# EAGLE design Edge Touch Module (EAGLE 6.3)
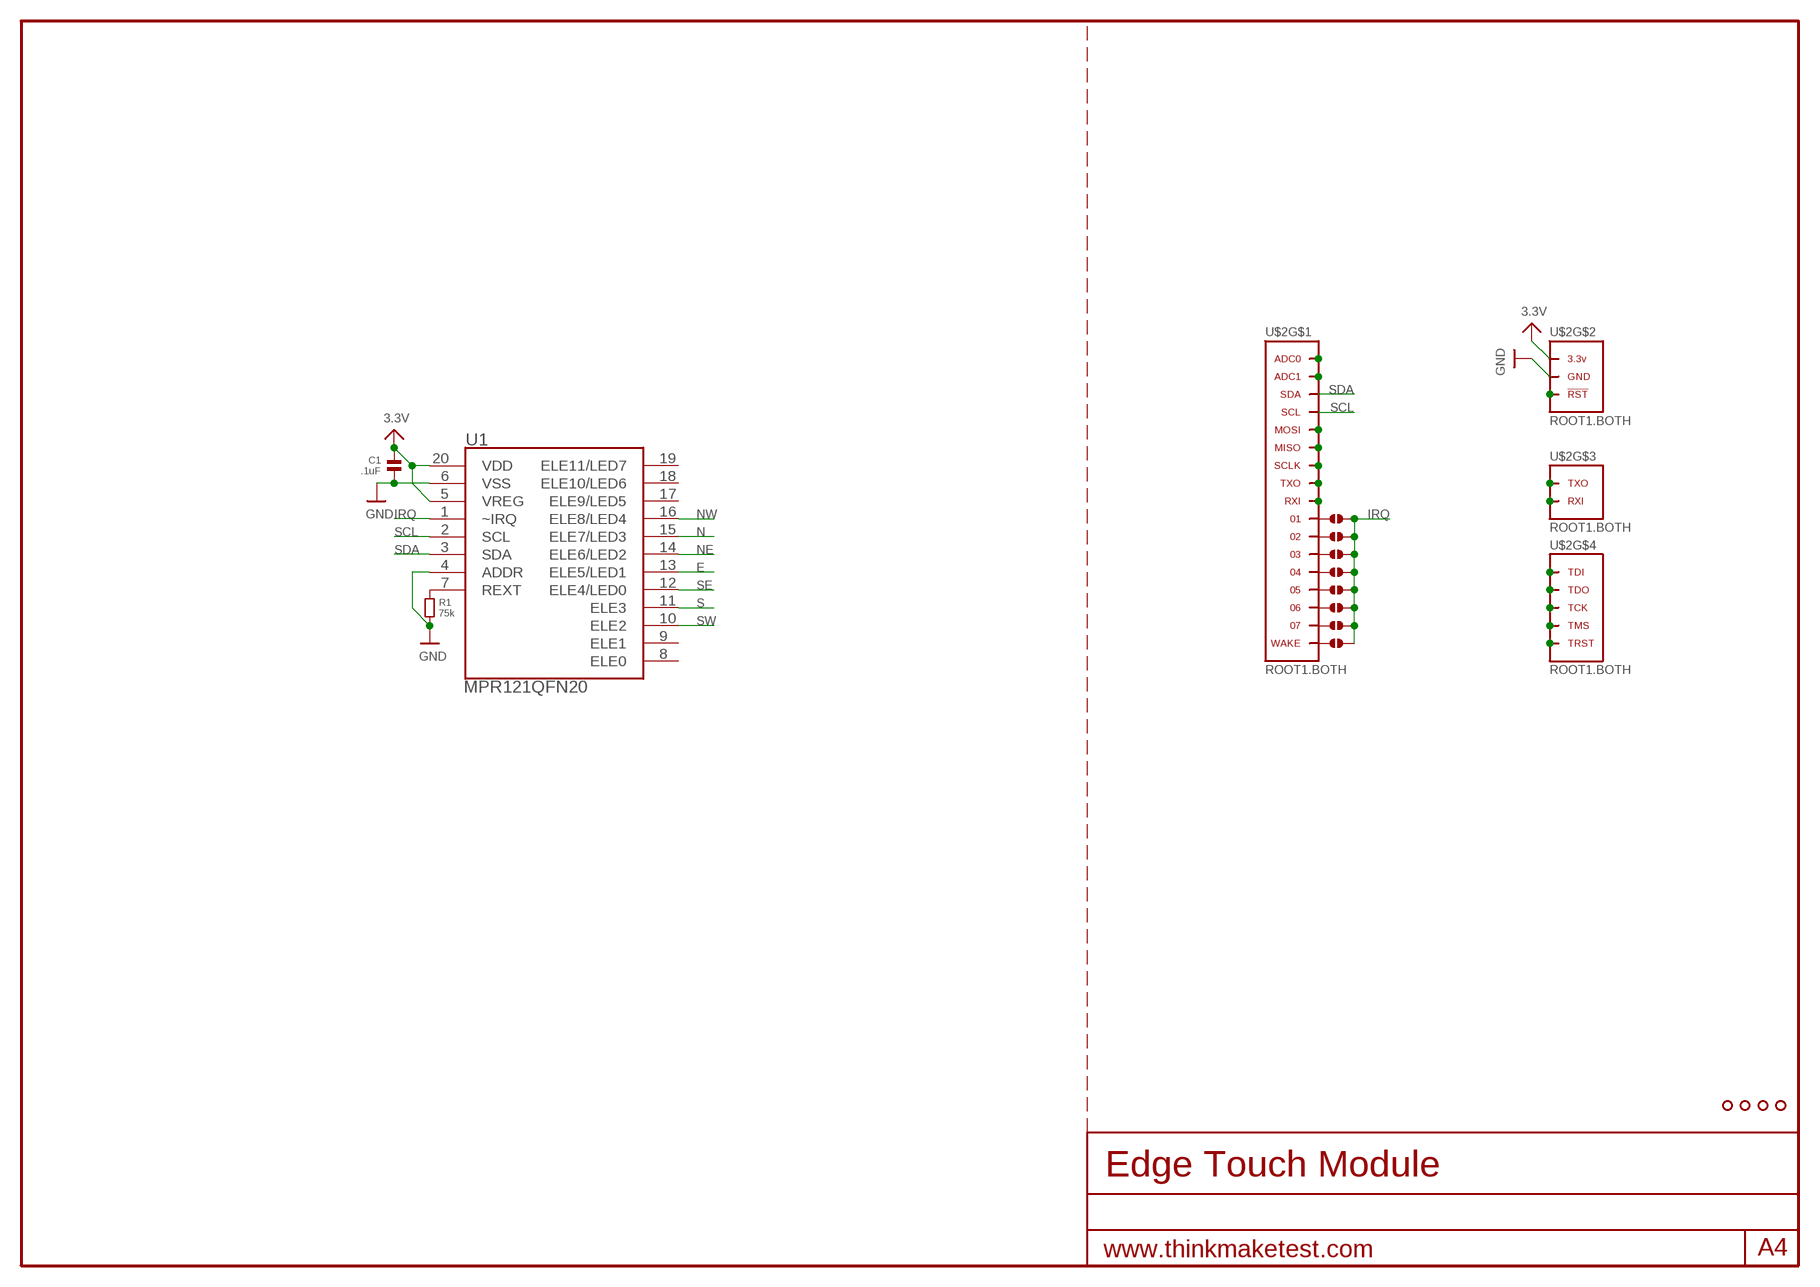
[diagram p0: schematic, sheet 1]

## Parts
1  SOLDERJUMPER.2.SML  [2.SML]
8  SOLDERJUMPER.2.SML  [2.SML]
C1  .1uF  CAPACITOR.0603  [0603]
J2  SOLDERJUMPER.2.SML  [2.SML]
J3  SOLDERJUMPER.2.SML  [2.SML]
J4  SOLDERJUMPER.2.SML  [2.SML]
J5  SOLDERJUMPER.2.SML  [2.SML]
J6  SOLDERJUMPER.2.SML  [2.SML]
J7  SOLDERJUMPER.2.SML  [2.SML]
R1  75k  RESISTOR.0603  [0603]
U1  MPR121QFN20  [QFN-20-0.4MM]
U$2  ROOT1.BOTH  [ROOT1.BOTH]
U$3  HOLE.#2  [#2]
U$4  HOLE.#2  [#2]
U$9  HOLE.#2  [#2]
U$10  HOLE.#2  [#2]

## Nets
3.3V: C1.1 U1.5(VREG) U1.20(VDD) U$2.3.3V@1(3.3V) U$2.3.3V@2(3.3V) U$2.3.3V@3(3.3V) U$2.3.3V@4(3.3V) U$2.3.3V@5(3.3V) U$2.3.3V@6(3.3V) U$2.3.3V@7(3.3V) U$2.3.3V@8(3.3V) U$2.3.3V@9(3.3V) U$2.3.3V@10(3.3V) U$2.3.3V@11(3.3V) U$2.3.3V@12(3.3V) U$2.3.3V@13(3.3V) U$2.3.3V@14(3.3V) U$2.3.3V@15(3.3V) U$2.3.3V@16(3.3V) U$2.3.3V@17(3.3V) U$2.3.3V@18(3.3V) U$2.3.3V@19(3.3V) U$2.3.3V@20(3.3V) U$2.3.3V@21(3.3V) U$2.3.3V@22(3.3V) U$2.3.3V@23(3.3V) U$2.3.3V@24(3.3V) U$2.3.3V@VIA(3.3V)
E: U1.13(ELE5/LED1)
GND: C1.2 R1.2 U1.4(ADDR) U1.6(VSS) U$2.GND@1(GND) U$2.GND@2(GND) U$2.GND@3(GND) U$2.GND@4(GND) U$2.GND@5(GND) U$2.GND@6(GND) U$2.GND@7(GND) U$2.GND@8(GND) U$2.GND@9(GND) U$2.GND@10(GND) U$2.GND@11(GND) U$2.GND@12(GND) U$2.GND@13(GND) U$2.GND@14(GND) U$2.GND@15(GND) U$2.GND@16(GND) U$2.GND@17(GND) U$2.GND@18(GND) U$2.GND@19(GND) U$2.GND@20(GND) U$2.GND@21(GND) U$2.GND@22(GND) U$2.GND@23(GND) U$2.GND@24(GND) U$2.GND@25(GND) U$2.GND@26(GND) U$2.GND@VIA(GND)
IRQ: 1.2 8.2 J2.2 J3.2 J4.2 J5.2 J6.2 J7.2 U1.1(~IRQ)
N: U1.15(ELE7/LED3)
N$1: 1.1 U$2.01 U$2.01@1 U$2.01@VIA
N$2: U$2.ADC1 U$2.ADC1@1(ADC1) U$2.ADC1@VIA(ADC1)
N$3: J2.1 U$2.02 U$2.02@1 U$2.02@VIA
N$5: J3.1 U$2.03 U$2.03@1 U$2.03@VIA
N$6: U$2.MISO U$2.MISO@1(MISO) U$2.MISO@VIA(MISO)
N$7: U$2.SCLK U$2.SCLK@1(SCLK) U$2.SCLK@VIA(SCLK)
N$8: U$2.TXO U$2.TXO@1(TXO) U$2.TXO@VIA(TXO)
N$9: U$2.RXI U$2.RXI@1(RXI) U$2.RXI@VIA(RXI)
N$10: J4.1 U$2.04 U$2.04@1 U$2.04@VIA
N$11: J5.1 U$2.05 U$2.05@1 U$2.05@VIA
N$12: U$2.MOSI U$2.MOSI@1(MOSI) U$2.MOSI@VIA(MOSI)
N$13: U$2.ADC0 U$2.ADC0@1(ADC0) U$2.ADC0@VIA(ADC0)
N$14: J6.1 U$2.06 U$2.06@1 U$2.06@VIA
N$15: J7.1 U$2.07 U$2.07@1 U$2.07@VIA
N$16: 8.1 U$2.WAKE U$2.WAKE@1(WAKE) U$2.WAKE@VIA(WAKE)
N$18: U$2.TDI U$2.TDI@1(TDI) U$2.TDI@VIA(TDI)
N$19: U$2.TDO U$2.TDO@1(TDO) U$2.TDO@VIA(TDO)
N$20: U$2.TCK U$2.TCK@1(TCK) U$2.TCK@VIA(TCK)
N$21: U$2.TMS U$2.TMS@1(TMS) U$2.TMS@VIA(TMS)
N$22: U$2.TRST U$2.TRST@1(TRST) U$2.TRST@VIA(TRST)
N$23: U$2.RXI.DBG(RXI) U$2.RXI.DBG@1(RXI) U$2.RXI.DBG@VIA(RXI)
N$24: U$2.TXO.DBG(TXO) U$2.TXO.DBG@1(TXO) U$2.TXO.DBG@VIA(TXO)
N$25: U$2.RST(!RST) U$2.RST@1(!RST) U$2.RST@VIA(!RST)
N$26: R1.1 U1.7(REXT)
NE: U1.14(ELE6/LED2)
NW: U1.16(ELE8/LED4)
S: U1.11(ELE3)
SCL: U1.2(SCL) U$2.SCL U$2.SCL@1(SCL) U$2.SCL@VIA(SCL)
SDA: U1.3(SDA) U$2.SDA U$2.SDA@1(SDA) U$2.SDA@VIA(SDA)
SE: U1.12(ELE4/LED0)
SW: U1.10(ELE2)
Unconnected: U1.8(ELE0) U1.9(ELE1) U1.17(ELE9/LED5) U1.18(ELE10/LED6) U1.19(ELE11/LED7)

## Library data of the parts
1 8 J2-J7 = .solderjumper:SOLDERJUMPER.2
C1 = .standardparts:CAPACITOR
R1 = .standardparts:RESISTOR
U1 = SparkFun-Sensors:MPR121: MPR121 Capacitive Touch Sensor Controller
U$2 = thinkmaketest:ROOT1
U$3 U$4 U$9 U$10 = .screw_holes:HOLE

## Board
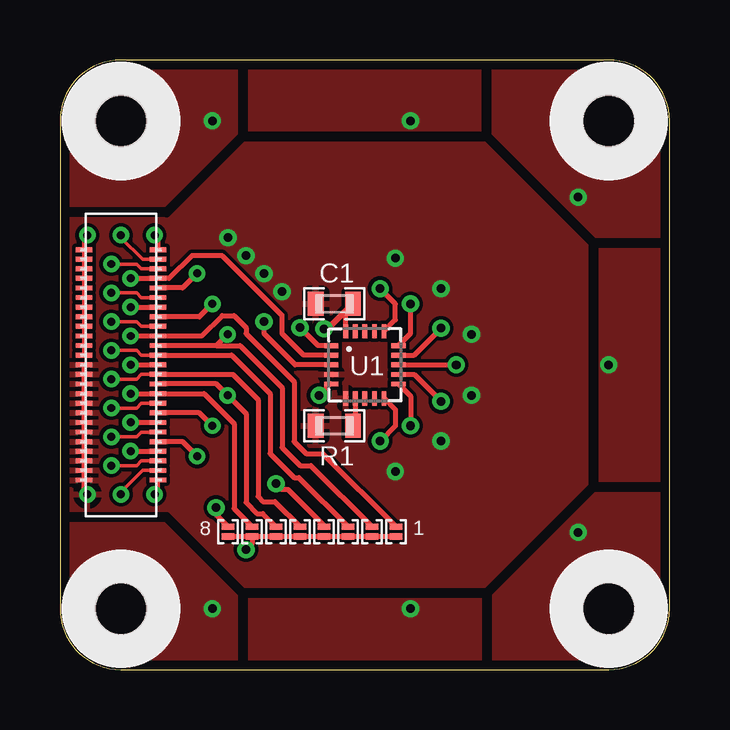
[diagram p1: board, top side]
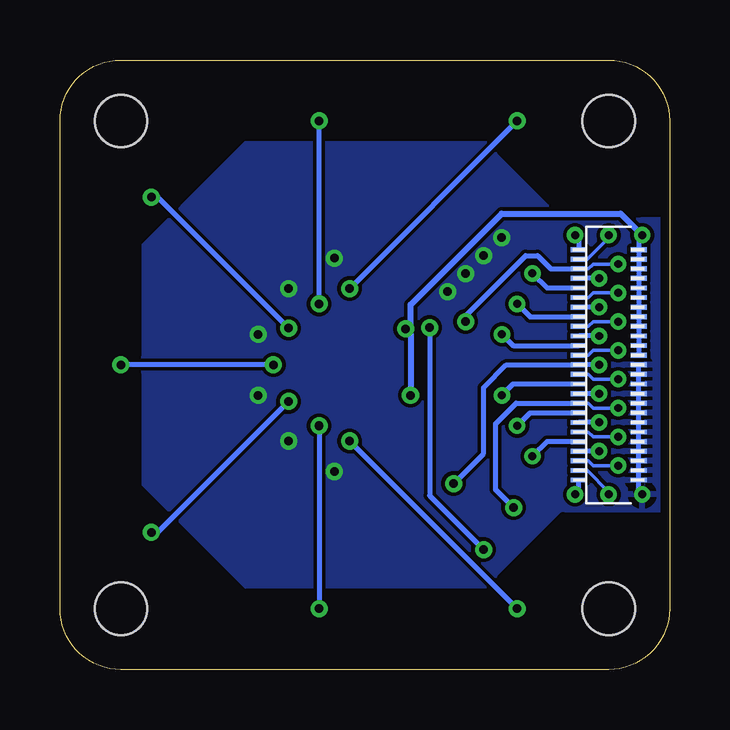
[diagram p2: board, bottom side, seen from below]

Size 25.4 x 25.4 mm. Coordinates in mm from the lower left corner, seen from the top.
Outline: 0,22.86 0,2.54 arc90 2.54,0 22.86,0 arc90 25.4,2.54 25.4,22.86 arc90 22.86,25.4 2.54,25.4 arc90 0,22.86
Copper layers (1*16): Top 0.0356mm / dielectric 1.5011mm / Bottom 0.0356mm
Design rules "default": minimum track width 6mil, minimum drill 13mil, track to track 6mil, track to pad 6mil, pad to pad 6mil, via to via 6mil, smd to smd 6mil, copper to edge 15mil, drill to drill 6mil, minimum pad ring 7mil, minimum via ring 7mil, stop-mask expansion 4mil, vias tented up to drill 16mil, thermal gap 10mil
tRestrict: 15 lines
bRestrict: 14 lines

### Footprints (pad centres in the part's own frame; a part is rotated, then mirrored left to right if it is on the bottom)
2.SML = smd 0.254 x 0.508: 1 -0.203,0; 2 0.203,0
0603 = smd 0.65 x 1: 1 -0.775,0; 2 0.775,0
QFN-20-0.4MM = smd 0.6 x 0.2: 1 -1.4,0.8; 2 -1.4,0.4; 3 -1.4,0; 4 -1.4,-0.4; 5 -1.4,-0.8; 11 1.4,-0.8; 12 1.4,-0.4; 13 1.4,0; 14 1.4,0.4; 15 1.4,0.8 | smd 0.2 x 0.6: 6 -0.8,-1.4; 7 -0.4,-1.4; 8 0,-1.4; 9 0.4,-1.4; 10 0.8,-1.4; 16 0.8,1.4; 17 0.4,1.4; 18 0,1.4; 19 -0.4,1.4; 20 -0.8,1.4
ROOT1.BOTH = smd 0.66 x 0.2 bottom: 01 3.795,13.9; 02 3.795,13.5; 03 3.795,13.1; 3.3V@1 1.285,17.5; 3.3V@2 1.285,17.1; 3.3V@3 1.285,16.7; 3.3V@4 1.285,16.3; 3.3V@5 1.285,15.9; 3.3V@6 1.285,15.5; 3.3V@7 1.285,15.1; 3.3V@8 1.285,14.7; 3.3V@9 1.285,14.3; 3.3V@10 1.285,13.9; 3.3V@11 1.285,13.5; 3.3V@12 1.285,13.1; 04 3.795,12.7; 05 3.795,12.3; 06 3.795,11.9; 07 3.795,11.5; ADC0 3.795,17.5; ADC1 3.795,17.1; GND@1 1.285,7.9; GND@2 1.285,8.3; GND@3 1.285,8.7; GND@4 1.285,9.1; GND@5 1.285,9.5; GND@6 1.285,9.9; GND@7 1.285,10.3; GND@8 1.285,10.7; GND@9 1.285,11.1; GND@10 1.285,11.5; GND@11 1.285,11.9; GND@12 1.285,12.3; GND@13 1.285,12.7; MISO 3.795,15.5; MOSI 3.795,15.9; RST 3.795,7.9; RXI 3.795,14.3; RXI.DBG 3.795,10.3; SCL 3.795,16.3; SCLK 3.795,15.1; SDA 3.795,16.7; TCK 3.795,9.1; TDI 3.795,9.9; TDO 3.795,9.5; TMS 3.795,8.7; TRST 3.795,8.3; TXO 3.795,14.7; TXO.DBG 3.795,10.7; WAKE 3.795,11.1 | smd 0.7 x 0.2: 01@1 4.08,13.9; 02@1 4.08,13.5; 3.3V@13 1,17.5; 3.3V@14 1,17.1; 3.3V@15 1,16.7; 3.3V@16 1,16.3; 3.3V@17 1,15.9; 3.3V@18 1,15.5; 3.3V@19 1,15.1; 3.3V@20 1,14.7; 3.3V@21 1,14.3; 3.3V@22 1,13.9; 3.3V@23 1,13.5; 3.3V@24 1,13.1; 03@1 4.08,13.1; 04@1 4.08,12.7; 05@1 4.08,12.3; 06@1 4.08,11.9; 07@1 4.08,11.5; ADC0@1 4.08,17.5; ADC1@1 4.08,17.1; GND@14 1,7.9; GND@15 1,8.3; GND@16 1,8.7; GND@17 1,9.1; GND@18 1,9.5; GND@19 1,9.9; GND@20 1,10.3; GND@21 1,10.7; GND@22 1,11.1; GND@23 1,11.5; GND@24 1,11.9; GND@25 1,12.3; GND@26 1,12.7; MISO@1 4.08,15.5; MOSI@1 4.08,15.9; RST@1 4.08,7.9; RXI.DBG@1 4.08,10.3; RXI@1 4.08,14.3; SCL@1 4.08,16.3; SCLK@1 4.08,15.1; SDA@1 4.08,16.7; TCK@1 4.08,9.1; TDI@1 4.08,9.9; TDO@1 4.08,9.5; TMS@1 4.08,8.7; TRST@1 4.08,8.3; TXO.DBG@1 4.08,10.7; TXO@1 4.08,14.7; WAKE@1 4.08,11.1 | drill 0.33 pad 0.686: 01@VIA 2.94,13.9; 02@VIA 6.985,13.97; 3.3V@VIA 1.14,18.1; 03@VIA 2.14,13.3; 04@VIA 2.94,12.7; 05@VIA 2.14,12.1; 06@VIA 6.985,11.43; 07@VIA 2.94,11.5; ADC0@VIA 3.94,18.1; ADC1@VIA 2.54,18.1; GND@VIA 1.14,7.3; MISO@VIA 2.14,15.7; MOSI@VIA 5.715,16.51; RST@VIA 3.94,7.3; RXI.DBG@VIA 2.94,10.3; RXI@VIA 2.14,14.5; SCL@VIA 2.94,16.3; SCLK@VIA 2.94,15.1; SDA@VIA 2.14,16.9; TCK@VIA 2.94,9.1; TDI@VIA 2.14,9.7; TDO@VIA 5.715,8.89; TMS@VIA 2.14,8.5; TRST@VIA 2.54,7.3; TXO.DBG@VIA 6.35,10.16; TXO@VIA 6.35,15.24; WAKE@VIA 2.14,10.9
#2 = hole 2.184: 0,0

### Placement (x,y rotation side)
1  14,5.75 270 top
8  7,5.75 270 top
C1  11.43,15.24 180 top
J2  13,5.75 270 top
J3  12,5.75 270 top
J4  11,5.75 270 top
J5  10,5.75 270 top
J6  9,5.75 270 top
J7  8,5.75 270 top
R1  11.43,10.16 180 top
U1  12.7,12.7 0 top
U$2  0,0 0 top
U$3  2.54,2.54 90 top
U$4  2.54,22.86 90 top
U$9  22.86,22.86 0 top
U$10  22.86,2.54 0 top

### Tracks (layer width: path | path; a pad name or v marks a point on that pad's centre or on a via)
3.3V  (via drill 0.36)
  Top 0.203: U1.5 11.27,11.9 v10.79,11.43 | U1.20 11.9,14.94 C1.1
  Top 0.254: C1.1 11.16,14.2 v11,14.2
  Bottom 0.254: v11,14.2 10.79,13.99 | 10.79,13.99 v10.79,11.43 | 10.79,13.99 10.79,15.21 7,19 2.04,19 U$2.3.3V@VIA
E  (via drill 0.36)
  Top 0.203: U1.13 v16.51,12.7
  Bottom 0.203: v16.51,12.7 v22.86,12.7
  pour Top: 22.23,17.78 22.23,7.62 25.4,7.62 25.4,17.78
GND  (via drill 0.36)
  other vias: 7.75,17.25 8.5,16.5 9.25,15.75 7,18 13.97,8.26 15.88,9.53 17.14,11.43 17.14,13.97 15.88,15.88 13.97,17.14
  pour Bottom (rank 6): 0,6.35 4.45,6.35 7.62,3.17 17.78,3.17 22.23,7.62 22.23,17.78 17.78,22.23 7.62,22.23 4.45,19.05 0,19.05
  pour Top (rank 6): 0,0 25.4,0 25.4,25.4 0,25.4
IRQ  (via drill 0.36)
  Top 0.203: U1.1 10.75,13.5 v10,14.25 | 8.2 J7.2 | J7.2 J6.2 J5.2 J4.2 J3.2 J2.2 1.2 | J7.2 8,5.25 v7.75,5
  Bottom 0.203: v10,14.25 10,7.25 v7.75,5
N  (via drill 0.36)
  Top 0.203: U1.15 14.61,14.01 v14.61,15.24
  Bottom 0.203: v14.61,15.24 v14.61,22.86
  pour Top: 17.78,25.4 7.62,25.4 7.62,22.23 17.78,22.23
N$1
  Top 0.203: U$2.01@1 5.9,13.9 6.75,14.75 7.25,14.75 7.75,14.25 7.75,14 9.75,12 9.75,9.5 10.25,9 10.95,9 1.1
N$3
  Top 0.203: 6.51,13.5 7.5,13.5 9.25,11.75 9.25,9.25 10,8.5 10.45,8.5 J2.1
N$5
  Top 0.203: U$2.03@1 7.15,13.1 8.75,11.5 8.75,9 9.75,8 9.95,8 J3.1
N$10  (via drill 0.36)
  Top 0.203: J4.1 11,6 9.5,7.5 9.25,7.5 v9,7.75
  Bottom 0.203: v9,7.75 7.75,9 7.75,11.75 6.8,12.7 U$2.04
N$11
  Top 0.203: U$2.05@1 7.2,12.3 8.25,11.25 8.25,7.2 8.45,7 8.95,7 J5.1
N$14
  Top 0.203: U$2.06@VIA 7.75,10.66 7.75,6.95 8.2,6.5 8.45,6.5 J6.1
N$15
  Top 0.203: U$2.07@1 6,11.5 7.25,10.25 7.25,6.7 J7.1
N$16  (via drill 0.36)
  Top 0.203: v6.5,6.75 6.5,6.45 8.1
  Bottom 0.203: v6.5,6.75 7.25,7.5 7.25,10.25 6.4,11.1 U$2.WAKE
N$26
  Top 0.203: U1.7 12.3,10.26 R1.1
NE  (via drill 0.36)
  Top 0.203: U1.14 14.75,13.1 v15.88,14.22
  Bottom 0.203: v15.88,14.22 21.34,19.68 v21.59,19.68
  pour Top (rank 2): 22.23,17.78 25.4,17.78 25.4,25.4 17.78,25.4 17.78,22.23
NW  (via drill 0.36)
  Top 0.203: U1.16 13.97,14.57 13.97,15.24 v13.34,15.88
  Bottom 0.203: v13.34,15.88 v6.35,22.86
  pour Top (rank 2): 7.62,22.23 7.62,25.4 0,25.4 0,19.05 4.45,19.05
S  (via drill 0.36)
  Top 0.203: U1.11 14.61,11.39 v14.61,10.16
  Bottom 0.203: v14.61,10.16 v14.61,2.54
  pour Top: 17.78,3.17 7.62,3.17 7.62,0 17.78,0
SCL
  Top 0.203: U$2.SCL@1 4.55,16.3 5.5,17.25 6.75,17.25 9.25,14.75 9.25,14 10.15,13.1 U1.2
SDA  (via drill 0.36)
  Top 0.203: U1.3 9.8,12.7 8.5,14 v8.5,14.5
  Bottom 0.203: v8.5,14.5 8.5,14.75 6,17.25 5.5,17.25 4.95,16.7 U$2.SDA
SE  (via drill 0.36)
  Top 0.203: U1.12 14.75,12.3 v15.88,11.18
  Bottom 0.203: v15.88,11.18 21.34,5.71 v21.59,5.71
  pour Top (rank 2): 22.23,7.62 25.4,7.62 25.4,0 17.78,0 17.78,3.17
SW  (via drill 0.36)
  Top 0.203: U1.10 13.97,10.83 13.97,10.16 v13.34,9.53
  Bottom 0.203: v13.34,9.53 v6.35,2.54
  pour Top (rank 2): 7.62,3.17 7.62,0 0,0 0,6.35 4.45,6.35

### Text on the board
bDocu: v1 | Cruz Monrreal II | AnomalousMaker.com